# Altium schematic sheet Tiresias_PMIC.SchDoc: Tiresias PMIC
size 393 x 281 mm; Author: João Victor Colombari Carlet; CompanyName: GMETA; DrawnBy: João Victor Colombari Carlet; Engineer: João Victor Colombari Carlet; Organization: R&D GMETA; Address1: EESC - USP; Address2: 400, Trabalhador São-Carlense Av.; Address3: 13566-590, São Carlos; Address4: São Paulo, Brazil; Revision: 0; SheetNumber: 4; SheetTotal: 5; Address_Website: http://www.sel.eesc.usp.br/jcarmo/metamaterials/
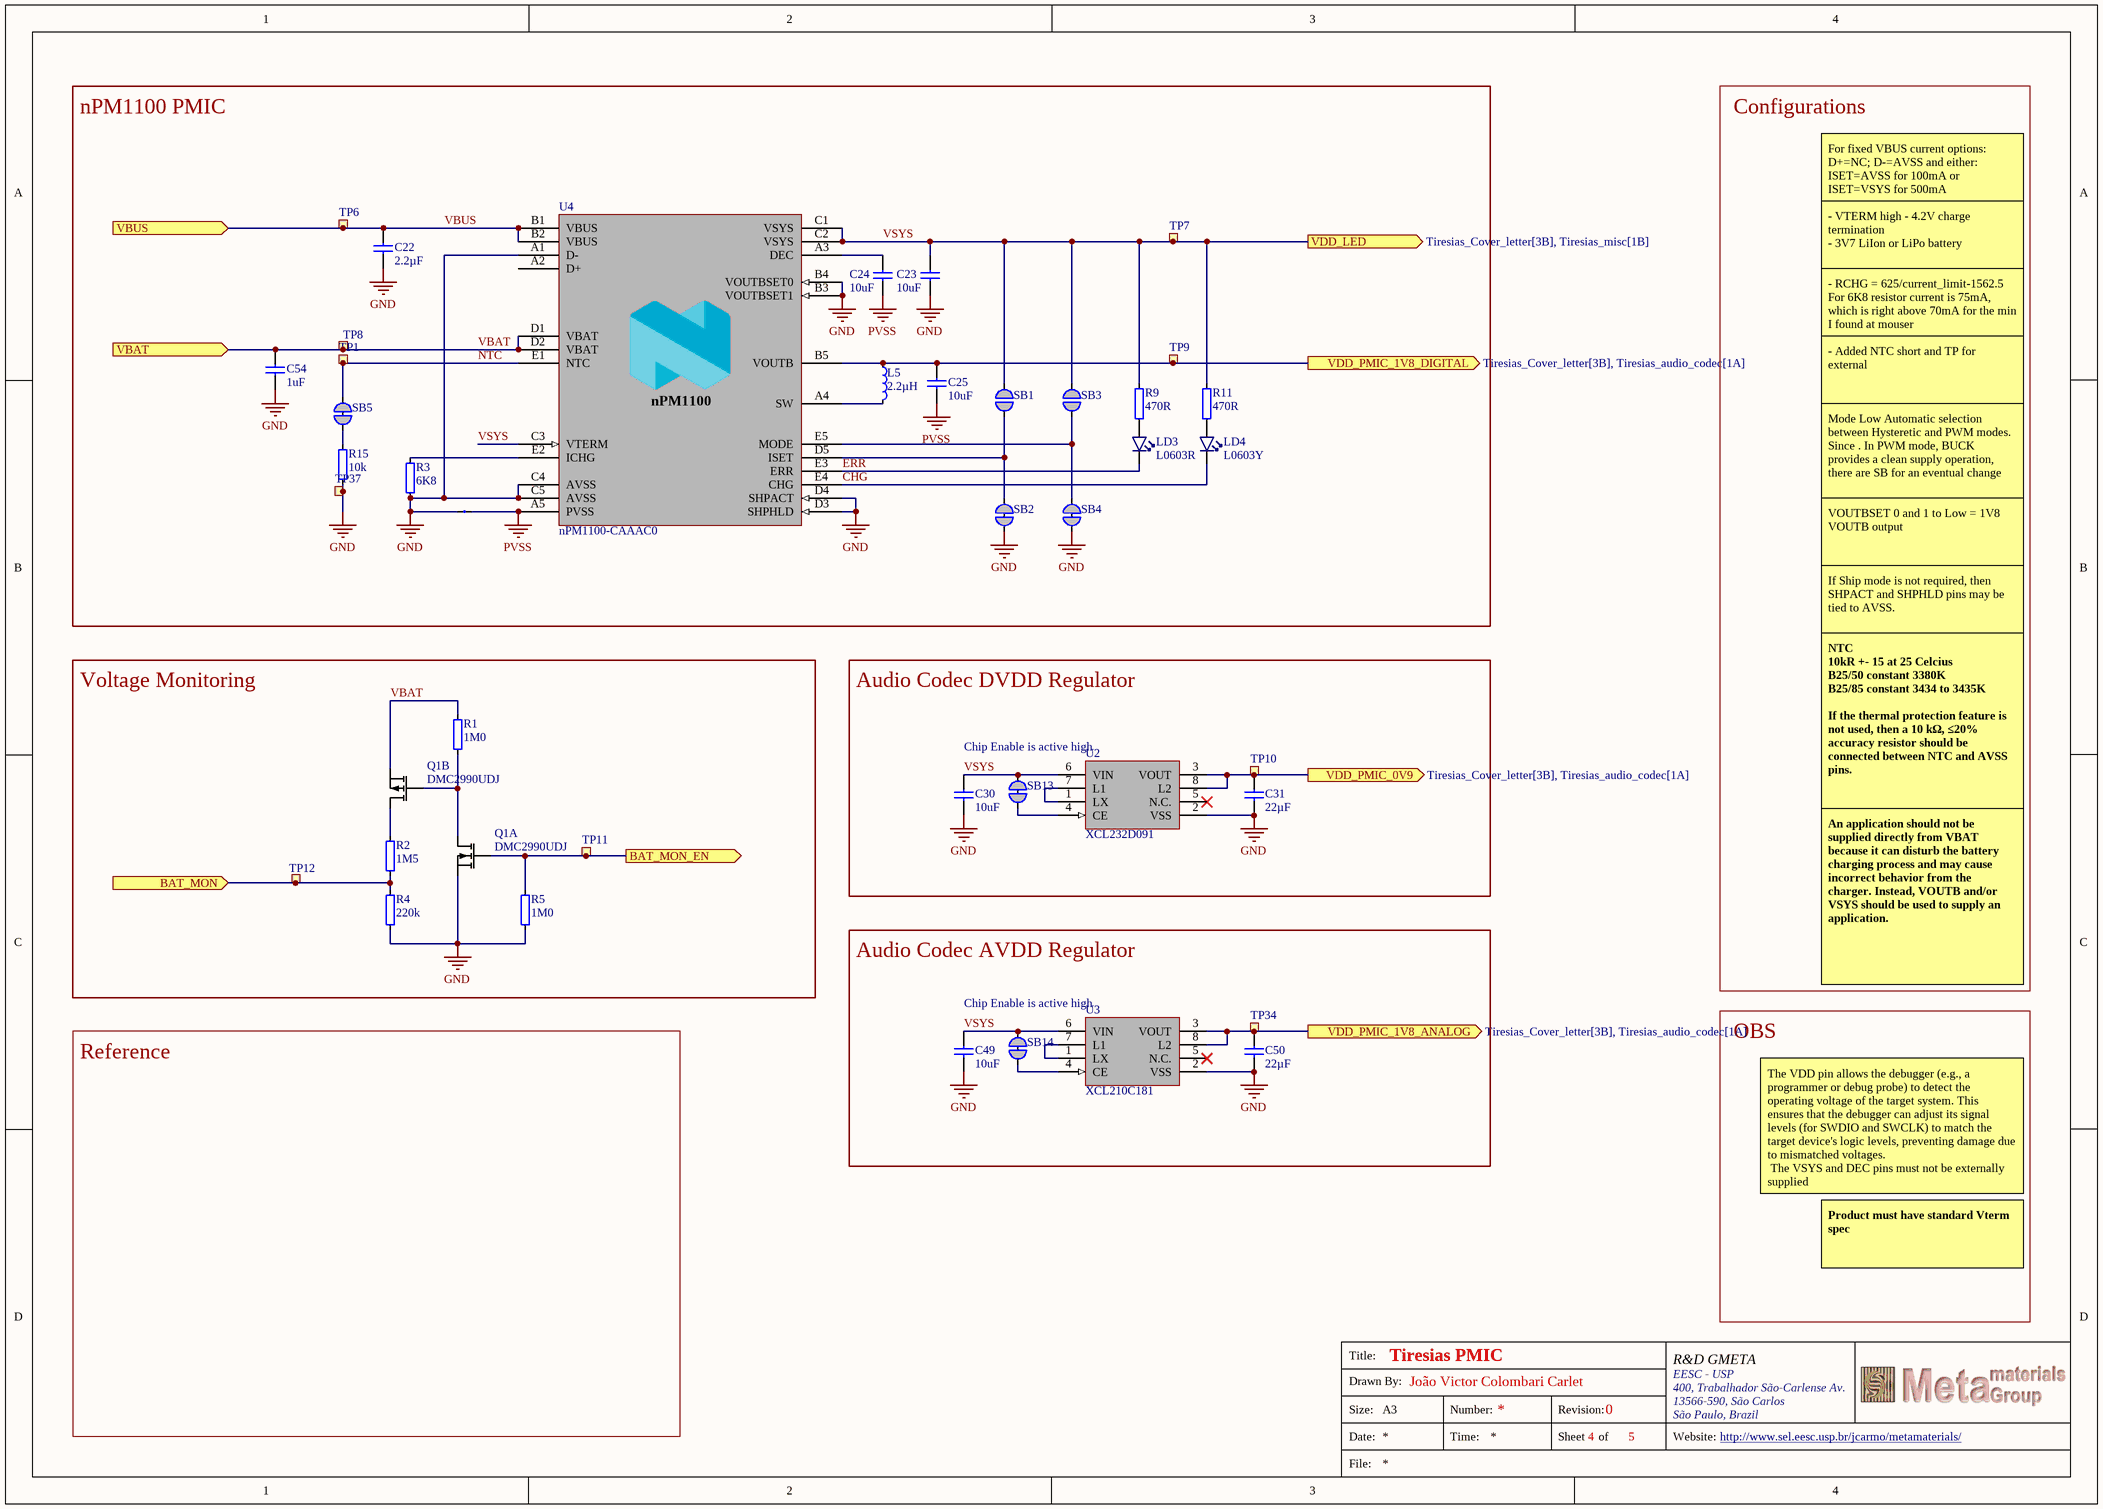
[diagram p0: Tiresias_PMIC.SchDoc]

## Parts
C22  2.2µF  [CAPC1608X06L]
C23  10uF  [CAPC1608X06L]
C24  10uF  [CAPC1608X06L]
C25  10uF  [CAPC1608X06L]
C30  10uF  [CAPC1608X06L]
C31  22µF  [CAPC1608X06L]
C49  10uF  [CAPC1608X06L]
C50  22µF  [CAPC1608X06L]
C54  1uF  [CAPC1005X04L]
J6  N.A.  [2 PIN STARPOINT]  (value not drawn)  (net tie, no BOM)
L5  2.2µH  [INDC2016X10N]
LD3  L0603R  [LED_0603_R]
LD4  L0603Y  [LED_0603_Y]
Q1  DMC2990UDJ  [SOTFL35P100X50-6N]  (parts A,B of 2)
R1  1M0  [RESC0603X03L_C]
R2  1M5  [RESC0603X03L_C]
R3  6K8  [RESC0603X03L_C]
R4  220k  [RESC0603X03L_C]
R5  1M0  [RESC0603X03L_C]
R9  470R  [RESC0603X03L_C]
R11  470R  [RESC0603X03L_C]
R15  10k  [RESC0603X03L_C]
SB1  Solderbridge  [Solderbridge]  (value not drawn)  (no BOM)
SB2  Solderbridge  [Solderbridge_Shorted]  (value not drawn)  (net tie, no BOM)
SB3  Solderbridge  [Solderbridge]  (value not drawn)  (no BOM)
SB4  Solderbridge  [Solderbridge_Shorted]  (value not drawn)  (net tie, no BOM)
SB5  Solderbridge  [Solderbridge_Shorted]  (value not drawn)  (net tie, no BOM)
SB13  Solderbridge  [Solderbridge_Shorted]  (value not drawn)  (net tie, no BOM)
SB14  Solderbridge  [Solderbridge_Shorted]  (value not drawn)  (net tie, no BOM)
TP1  Ø1.5mm,SMD  [TP_SMD_D1.5mm]  (value not drawn)  (no BOM)
TP6  Ø1.5mm,SMD  [TP_SMD_D1.5mm]  (value not drawn)  (no BOM)
TP7  Ø1.5mm,SMD  [TP_SMD_D1.5mm]  (value not drawn)  (no BOM)
TP8  Ø1.5mm,SMD  [TP_SMD_D1.5mm]  (value not drawn)  (no BOM)
TP9  Ø1.5mm,SMD  [TP_SMD_D1.5mm]  (value not drawn)  (no BOM)
TP10  Ø1.5mm,SMD  [TP_SMD_D1.5mm]  (value not drawn)  (no BOM)
TP11  Ø1.0mm,SMD  [TP_SMD_D1.0mm]  (value not drawn)  (no BOM)
TP12  Ø1.0mm,SMD  [TP_SMD_D1.0mm]  (value not drawn)  (no BOM)
TP34  Ø1.5mm,SMD  [TP_SMD_D1.5mm]  (value not drawn)  (no BOM)
TP37  Ø1.5mm,SMD  [TP_SMD_D1.5mm]  (value not drawn)  (no BOM)
U2  XCL232D091  [CL-2025]
U3  XCL210C181  [CL-2025]
U4  nPM1100-CAAAC0  [BGA25C40P5X5_200X200X50]

## Blocks framed on the sheet
nPM1100 PMIC: C22-C25 C54 J6 L5 LD3 LD4 R3 R9 R11 R15 SB1-SB5 TP1 TP6-TP9 TP37 U4
Voltage Monitoring: Q1 R1 R2 R4 R5 TP11 TP12
Audio Codec DVDD Regulator: C30 C31 SB13 TP10 U2
Audio Codec AVDD Regulator: C49 C50 SB14 TP34 U3

## Ports
BAT_MON (in, see Tiresias_Cover_letter[3B], Tiresias_MCU[4B]), BAT_MON_EN (out, see Tiresias_Cover_letter[3B], Tiresias_MCU[4B]), VBAT (in, see Tiresias_Cover_letter[3B], Tiresias_misc[1D]), VBUS (in, see Tiresias_Cover_letter[3B], Tiresias_misc[2D]), VDD_LED (out, see Tiresias_Cover_letter[3B], Tiresias_misc[1B]), VDD_PMIC_0V9 (out, see Tiresias_Cover_letter[3B], Tiresias_audio_codec[1A]), VDD_PMIC_1V8_ANALOG (out, see Tiresias_Cover_letter[3B], Tiresias_audio_codec[1A]), VDD_PMIC_1V8_DIGITAL (out, see Tiresias_Cover_letter[3B], Tiresias_audio_codec[1A])

## Nets
GND: C22.1 C23.1 C30.1 C31.1 C49.1 C50.1 C54.1 J6.1 Q1.1(S1) R3.2 R4.1 R5.1 R15.1 SB2.2 SB4.2 TP37.1 U2.2(VSS) U2.9(VSS) U3.2(VSS) U3.9(VSS) U4.A1(D-) U4.B3(VOUTBSET1) U4.B4(VOUTBSET0) U4.C4(AVSS) U4.C5(AVSS) U4.D3(SHPHLD) U4.D4(SHPACT)
PVSS: C24.1 C25.2 J6.2 U4.A5(PVSS)
BAT_MON: R2.1 R4.2 TP12.1 ; port BAT_MON
BAT_MON_EN: Q1.2(G1) R5.2 TP11.1 ; port BAT_MON_EN
CHG: LD4.1(C) U4.E4(CHG)
ERR: LD3.1(C) U4.E3(ERR)
NTC: SB5.1 TP1.1 U4.E1(NTC)
VBAT: C54.2 Q1.4(S2) R1.2 TP8.1 U4.D1(VBAT) U4.D2(VBAT) ; port VBAT
VBUS: C22.2 TP6.1 U4.B1(VBUS) U4.B2(VBUS) ; port VBUS
VDD_PMIC_0V9: C31.2 TP10.1 U2.3(VOUT) U2.8(L2) ; port VDD_PMIC_0V9
VDD_PMIC_1V8_ANALOG: C50.2 TP34.1 U3.3(VOUT) U3.8(L2) ; port VDD_PMIC_1V8_ANALOG
VDD_PMIC_1V8_DIGITAL: C25.1 L5.1 TP9.1 U4.B5(VOUTB) ; port VDD_PMIC_1V8_DIGITAL
VSYS: C23.2 C30.2 C49.2 R9.2 R11.2 SB1.1 SB3.1 SB13.1 SB14.1 TP7.1 U2.6(VIN) U3.6(VIN) U4.C1(VSYS) U4.C2(VSYS) U4.C3(VTERM) ; port VDD_LED
NetC24_2: C24.2 U4.A3(DEC)
NetL5_2: L5.2 U4.A4(SW)
NetLD3_2: LD3.2(A) R9.1
NetLD4_2: LD4.2(A) R11.1
NetQ1_3: Q1.3(D2) R2.2
NetQ1_5: Q1.5(G2) Q1.6(D1) R1.1
NetR3_1: R3.1 U4.E2(ICHG)
NetR15_2: R15.2 SB5.2
NetSB1_2: SB1.2 SB2.1 U4.D5(ISET)
NetSB3_2: SB3.2 SB4.1 U4.E5(MODE)
NetSB13_2: SB13.2 U2.4(CE)
NetSB14_2: SB14.2 U3.4(CE)
NetU2_1: U2.1(LX) U2.7(L1)
NetU3_1: U3.1(LX) U3.7(L1)

Not connected (* = marked no-connect by the designer): U2 5(N.C.)*; U3 5(N.C.)*; U4 A2(D+)

## Notes on the sheet
- Configurations
- For fixed VBUS current options:
  D+=NC; D-=AVSS and either:
  ISET=AVSS for 100mA or
  ISET=VSYS for 500mA
- - VTERM high - 4.2V charge termination
  - 3V7 LiIon or LiPo battery
- - RCHG = 625/current_limit-1562.5
  For 6K8 resistor current is 75mA,
  which is right above 70mA for the min I found at mouser
- - Added NTC short and TP for external
- Mode Low Automatic selection between Hysteretic and PWM modes. Since . In PWM mode, BUCK provides a clean supply operation, there are SB for an eventual change
- VOUTBSET 0 and 1 to Low = 1V8 VOUTB output
- If Ship mode is not required, then SHPACT and SHPHLD pins may be tied to AVSS.
- Chip Enable is active high
- NTC
  10kR +- 15 at 25 Celcius
  B25/50 constant 3380K
  B25/85 constant 3434 to 3435K
  If the thermal protection feature is not used, then a 10 kΩ, ≤20% accuracy resistor should be connected between NTC and AVSS pins.
- An application should not be supplied directly from VBAT because it can disturb the battery charging process and may cause incorrect behavior from the charger. Instead, VOUTB and/or VSYS should be used to supply an application.
- OBS
- Reference
- The VDD pin allows the debugger (e.g., a programmer or debug probe) to detect the operating voltage of the target system. This ensures that the debugger can adjust its signal levels (for SWDIO and SWCLK) to match the target device's logic levels, preventing damage due to mismatched voltages.
  The VSYS and DEC pins must not be externally supplied
- Product must have standard Vterm spec
- Title:
- Drawn By:
- Size:
- Date:
- File:
- A3
- Number:
- Time:
- Revision:
- Sheet
- of
- Website:
- (in symbol nPM1100-CAAAC0) nPM1100

## Library data of the parts
C22 = CAP_0603_2u2F: Capacitor, Ceramic, X5R, ±10%, 10V; Part Number: C0603-2µ2-10V-X5R; Manufacturer: N.A.; Pad Count: 2; Footprint Doc: 0603; Value: 2.2µF; Component Class: Capacitors; Author: rubr; Manufacturer Part Number: N.A.; ComponentLink1URL: N.A.; ComponentLink1Description: Datasheet; ComponentLink2URL: N.A.; ComponentLink2Description: Supplier link; HelpURL: N.A.; LatestRevisionDate: 2021-07-22; Published: 2021-07-22; Note: 10V; Supplier 1: N.A.; Supplier Part Number 1: N.A.; Supplier 2: N.A.; Supplier Part Number 2: N.A.; Artikkelnr Noca: N.A.; Part number IPS: N.A.; Part number Norautron: N.A.
C23-C25 C30 C49 = CAP_0603_10uF: Capacitor, X5R, ±10%; Part Number: C0603-10µ; Class: SMT; Manufacturer: *; Manufacturer Part Number: *; LatestRevisionDate: 2024/02/20; Value: 10uF; Package: 0603; Pin Count: 2
C31 C50 = CAP_0603_22uF: Capacitor, X5R, ±20%, 6.3V; Part Number: C0603-22µ; Manufacturer: N.A.; Pad Count: 2; Manufacturer Part Number: N.A.; Footprint Doc: 0603; LatestRevisionDate: 2020-09-23; Published: 2020-09-23; Value: 22µF; Note: 6.3V; Artikkelnr Noca: N.A.; Part number IPS: N.A.; ComponentLink1URL: N.A.; ComponentLink1Description: Datasheet; ComponentLink2URL: N.A.; ComponentLink2Description: Supplier link; HelpURL: N.A.; Supplier 1: N.A.; Supplier Part Number 1: N.A.; Supplier 2: N.A.; Supplier Part Number 2: N.A.; Component Class: Capacitors; PartId: 100200276; Author: rsk; Part number Norautron: N.A.
C54 = CAP_0402_1uF: Capacitor, X5R, ±5%; Part Number: C0402-1µ0; Class: SMT; Manufacturer: *; Manufacturer Part Number: *; LatestRevisionDate: 2024/02/20; Value: 1uF; Package: 0402; Pin Count: 2
J6 = 2 pin starpoint: Starpoint; Pad Count: 2; Footprint Doc: N.A.; Value: N.A.; Component Class: Connectors; Author: rsk; Part Number: 2 pin starpoint; PartId: 100500603; Manufacturer: N.A.; Manufacturer Part Number: N.A.; ComponentLink1URL: N.A.; ComponentLink1Description: Datasheet; ComponentLink2URL: N.A.; ComponentLink2Description: Supplier link; HelpURL: N.A.; LatestRevisionDate: 2017-08-31; Published: 2017-08-31; Note: N.A.; Supplier 1: N.A.; Supplier Part Number 1: N.A.; Supplier 2: N.A.; Supplier Part Number 2: N.A.; Artikkelnr Noca: N.A.; Part number IPS: N.A.; Part number Norautron: N.A.
L5 = IND_0806_2u2H: FIXED IND 2.2UH 2.5A 87MOHM SMD; Part Number: CIGT201610EH2R2MNE; Manufacturer: Samsung Electro-Mechanics; Pad Count: 2; Note: 2.2µH Unshielded Thin Film Inductor 2.5A 87mOhm Max 0806 (2016 Metric); Artikkelnr Noca: N.A.; Footprint Doc: 0806; Value: 2.2µH; Component Class: Inductors; Author: rsk; PartId: 100300400; Manufacturer Part Number: CIGT201610EH2R2MNE; ComponentLink1URL: https://media.digikey.com/pdf/Data%20Sheets/Samsung%20PDFs/CIGT201610EH2R2MNE_Spec.pdf; ComponentLink1Description: Datasheet; ComponentLink2URL: https://www.digikey.com/en/products/detail/samsung-electro-mechanics/CIGT201610EH2R2MNE/7041223?s=N4IgTCBcDaIMIEkDiAVMAGAjANk%2BgogBJgBKYAsgHL4gC6AvkA; ComponentLink2Description: Supplier link; HelpURL: http://product.samsungsem.com/pi/CIGT201610EH2R2MN.do; LatestRevisionDate: 2021-02-03; Published: 2021-02-03; Supplier 1: Digi-Key; Supplier Part Number 1: 1276-6901-1-ND; Supplier 2: Mouser; Supplier Part Number 2: 187-CIGT201610EH2R2M; Part number IPS: N.A.; Part number Norautron: N.A.
LD3 = LED_0603_RED: LED, SMD, 0603, RED; Part Number: OVS-0608 RED; Manufacturer: Multicomp; Pad Count: 2; Note: 100 mcd @ 20 mA, Super bright; Artikkelnr Noca: N.A.; Footprint Doc: 0603; Value: L0603R; Component Class: Optoelectronics; Author: rsk; PartId: 101400024; Manufacturer Part Number: OVS-0608; ComponentLink1URL: N.A.; ComponentLink1Description: Datasheet; ComponentLink2URL: N.A.; ComponentLink2Description: Supplier link; HelpURL: http://www.farnell.com/datasheets/1673654.pdf; LatestRevisionDate: 2011-10-28; Published: 2011-10-28; Supplier 1: Farnell; Supplier Part Number 1: 171-6774; Supplier 2: N.A.; Supplier Part Number 2: N.A.; Part number IPS: N.A.; Part number Norautron: N.A.
LD4 = LED_0603_YEL: LED, Yellow, 0603, 590nm, Vf=2.0V, 120mcd, - 40 to +85°C; Part Number: 150060YS75000; Manufacturer: Wurth Elektronik; Note: N.A.; Pad Count: 2; Manufacturer Part Number: 150060YS75000; ComponentLink1URL: https://katalog.we-online.de/led/datasheet/150060YS75000.pdf; ComponentLink1Description: Datasheet; ComponentLink2URL: https://www.digikey.com/en/products/detail/w%C3%BCrth-elektronik/150060YS75000/4489909; ComponentLink2Description: Supplier link; HelpURL: N.A.; Footprint Doc: 0603; LatestRevisionDate: 2020-11-04; Published: 2020-11-04; Value: L0603Y; Supplier 1: Digi-Key; Supplier Part Number 1: 732-4981-1-ND; Supplier 2: N.A.; Supplier Part Number 2: N.A.; Artikkelnr Noca: N.A.; Part number IPS: N.A.; Component Class: Optoelectronics; PartId: 101400136; Author: rsk; Part number Norautron: N.A.
Q1 = DMC2990UDJ-7: MOSFET, Dual N and P-Channel, 20V, 450mA/310mA, 990mOhm, 350mW; Manufacturer: Diodes Incorporated; Part number IPS: 00000004489; Note: N.A.; Pad Count: 6; Part Number: DMC2990UDJ-7; Manufacturer Part Number: DMC2990UDJ-7; Footprint Doc: SOT-963; LatestRevisionDate: 2020-04-28; Published: 2020-02-21; Value: DMC2990UDJ; Artikkelnr Noca: N.A.; Supplier 1: Digi-Key; Supplier Part Number 1: DMC2990UDJ-7DICT-ND; Supplier 2: N.A.; Supplier Part Number 2: N.A.; ComponentLink1URL: https://www.diodes.com/assets/Datasheets/DMC2990UDJ.pdf; ComponentLink1Description: Datasheet; ComponentLink2URL: N.A.; ComponentLink2Description: Supplier link; HelpURL: N.A.; Component Class: Semiconductors; PartId: 101300174; Author: rsk; Part number Norautron: N.A.
R1 R5 = RES_0201_1M0: Resistor, ±1%, 0.05W; Part Number: R0201-100k; Manufacturer: N.A.; Class: SMT; Latest Revision Date: 2024-04-23; ComponentLink1URL: N.A.; ComponentLink1Description: Datasheet; ComponentLink2URL: N.A.; ComponentLink2Description: Supplier link; Value: 1M0; Package: 0201; Pin Count: 2; JLCpcb link: Chip Res 1%; Mouser link: N.A.; DigiKey link: 00000001419; Author: rsk
R2 = RES_0201_1M5: Resistor, ±1%, 0.05W; Part Number: R0201-100k; Manufacturer: N.A.; Class: SMT; Latest Revision Date: 2024-04-23; ComponentLink1URL: N.A.; ComponentLink1Description: Datasheet; ComponentLink2URL: N.A.; ComponentLink2Description: Supplier link; Value: 1M5; Package: 0201; Pin Count: 2; JLCpcb link: Chip Res 1%; Mouser link: N.A.; DigiKey link: 00000001419; Author: rsk
R3 = RES_0201_6K8: Resistor, ±1%, 0.05W; Part Number: R0201-100k; Manufacturer: N.A.; Class: SMT; Latest Revision Date: 2024-04-23; ComponentLink1URL: N.A.; ComponentLink1Description: Datasheet; ComponentLink2URL: N.A.; ComponentLink2Description: Supplier link; Value: 6K8; Package: 0201; Pin Count: 2; JLCpcb link: Chip Res 1%; Mouser link: N.A.; DigiKey link: 00000001419; Author: rsk
R4 = RES_0201_220K: Resistor, ±1%, 0.05W; Part Number: R0201-100k; Manufacturer: N.A.; Class: SMT; Latest Revision Date: 2024-04-23; ComponentLink1URL: N.A.; ComponentLink1Description: Datasheet; ComponentLink2URL: N.A.; ComponentLink2Description: Supplier link; Value: 220k; Package: 0201; Pin Count: 2; JLCpcb link: Chip Res 1%; Mouser link: N.A.; DigiKey link: 00000001419; Author: rsk
R9 R11 = RES_0201_470R: Resistor, ±1%, 0.05W; Part Number: R0201-470; Manufacturer: N.A.; Note: Chip Res 1%; Pad Count: 2; Manufacturer Part Number: N.A.; ComponentLink1URL: N.A.; ComponentLink1Description: Datasheet; ComponentLink2URL: N.A.; ComponentLink2Description: Supplier link; HelpURL: N.A.; Footprint Doc: 0201; LatestRevisionDate: 2014-11-13; Published: 2014-11-13; Value: 470R; Artikkelnr Noca: N.A.; Part number IPS: N.A.; Supplier 1: N.A.; Supplier Part Number 1: N.A.; Supplier 2: N.A.; Supplier Part Number 2: N.A.; Component Class: Resistors; PartId: 100100037; Author: rsk; Part number Norautron: N.A.
R15 = RES_0201_10K: Resistor, ±1%, 0.05W; Part Number: R0201-100k; Manufacturer: N.A.; Class: SMT; Latest Revision Date: 2024-04-23; ComponentLink1URL: N.A.; ComponentLink1Description: Datasheet; ComponentLink2URL: N.A.; ComponentLink2Description: Supplier link; Value: 10k; Package: 0201; Pin Count: 2; JLCpcb link: Chip Res 1%; Mouser link: N.A.; DigiKey link: 00000001419; Author: rsk
SB1 SB3 = Solderbridge: Manufacturer: N.A.; Pad Count: 2; Part Number: Solderbridge; Manufacturer Part Number: N.A.; ComponentLink1URL: N.A.; ComponentLink1Description: Datasheet; ComponentLink2URL: N.A.; ComponentLink2Description: Supplier link; HelpURL: N.A.; Footprint Doc: Solderbridge; LatestRevisionDate: 2009-12-14; Published: 2009-12-14; Value: Solderbridge; Note: N.A.; Supplier 1: N.A.; Supplier Part Number 1: N.A.; Supplier 2: N.A.; Supplier Part Number 2: N.A.; Artikkelnr Noca: N.A.; Part number IPS: N.A.; Component Class: Connectors; PartId: 100500458; Author: rsk; Part number Norautron: N.A.
SB2 SB4 SB5 SB13 SB14 = Solderbridge Shorted: Shorted Solderbridge; Manufacturer: N.A.; Pad Count: 2; Part Number: Solderbridge Shorted; Manufacturer Part Number: N.A.; ComponentLink1URL: N.A.; ComponentLink1Description: Datasheet; ComponentLink2URL: N.A.; ComponentLink2Description: Supplier link; HelpURL: N.A.; Footprint Doc: Solderbridge_Shorted; LatestRevisionDate: 2012-08-07; Published: 2012-08-07; Value: Solderbridge; Note: N.A.; Supplier 1: N.A.; Supplier Part Number 1: N.A.; Supplier 2: N.A.; Supplier Part Number 2: N.A.; Artikkelnr Noca: N.A.; Part number IPS: N.A.; Component Class: Connectors; PartId: 100500459; Author: rsk; Part number Norautron: N.A.
TP1 TP6-TP10 TP34 TP37 = TP_SMD_Ø1.5MM: 1.5mm circular SMD testpad; Manufacturer: Nordic Semiconductor; Manufacturer Part Number: N.A.; Pad Count: 1; Part Number: TP_SMD_Ø1.5MM; LatestRevisionDate: 2021-03-05; Published: 2016-06-02; Value: Ø1.5mm,SMD; Note: N.A.; Artikkelnr Noca: N.A.; Footprint Doc: TP_SMD_Ø1.5mm; Part number IPS: N.A.; ComponentLink1URL: N.A.; ComponentLink1Description: Datasheet; ComponentLink2URL: N.A.; ComponentLink2Description: Supplier link; HelpURL: N.A.; Supplier 1: N.A.; Supplier Part Number 1: N.A.; Supplier 2: N.A.; Supplier Part Number 2: N.A.; Component Class: Connectors; PartId: 100500477; Author: rsk; Part number Norautron: N.A.
TP11 TP12 = TP_SMD_Ø1.0MM: 1.0mm circular SMD testpad; Manufacturer: Nordic Semiconductor; Manufacturer Part Number: N.A.; Pad Count: 1; Part Number: TP_SMD_Ø1.0MM; ComponentLink1URL: N.A.; ComponentLink1Description: Datasheet; ComponentLink2URL: N.A.; ComponentLink2Description: Supplier link; HelpURL: N.A.; Footprint Doc: TP_SMD_Ø1.0mm; LatestRevisionDate: 2021-03-05; Published: 2013-06-11; Value: Ø1.0mm,SMD; Note: N.A.; Supplier 1: N.A.; Supplier Part Number 1: N.A.; Supplier 2: N.A.; Supplier Part Number 2: N.A.; Artikkelnr Noca: N.A.; Part number IPS: N.A.; Component Class: Connectors; PartId: 100500475; Author: rsk; Part number Norautron: N.A.
U2 = XCL232D091KR-G: 0.9V Ultra-Low Quiescent Current, Inductor Built-in Step-Down DC/DC Converter, CL-2025-03   Source:  Datasheet; Part Number: XCL210C12; Manufacturer: Torex Semiconductor; Manufacturer Part Number: XCL210C121GR-G; Note: N.A.; Pad Count: 8; Footprint Doc: CL-2025; LatestRevisionDate: 2021-04-22; Published: 2021-04-22; Value: XCL232D091; Artikkelnr Noca: N.A.; Part number IPS: N.A.; ComponentLink1URL: https://www.torexsemi.com/file/xcl210/XCL210.pdf; ComponentLink1Description: Datasheet; ComponentLink2URL: https://www.digikey.com/en/products/detail/torex-semiconductor-ltd/XCL210C121GR-G/5964723; ComponentLink2Description: Supplier link; HelpURL: https://www.torexsemi.com/products/built-in-dcdc-converters/series/?name=xcl210; Supplier 1: Digi-Key; Supplier Part Number 1: 893-1249-1-ND; Supplier 2: Mouser; Supplier Part Number 2: 865-XCL210C121GR-G; Component Class: Misc_ICs; Author: rubr; Part number Norautron: N.A.; PartId: 101900655; Mouser Link: https://au.mouser.com/ProductDetail/Torex-Semiconductor/XCL210D201GR-G?qs=AsjdqWjXhJ%252Bfq4YmN5RHyA%3D%3D&_gl=1*8wexd*_ga*MTYyMjg1NzA0OC4xNzEzODc4NTc0*_ga_15W4STQT4T*MTcxMzk3OTMxMS4zLjAuMTcxMzk3OTMxMi41OS4wLjA.; Digikey Link: https://www.digikey.com/en/products/detail/torex-semiconductor-ltd/XCL210D201GR-G/10148097?s=N4IgTCBcDaIBoGEAyYCMAGAImdqDiASgLR4gC6AvkA
U3 = XCL210C18: 1.8V, 200mA Inductor Built-in Step-Down “micro DC/DC” Converter; Part Number: XCL210C12; Manufacturer: Torex Semiconductor; Manufacturer Part Number: XCL210C121GR-G; Note: N.A.; Pad Count: 8; Footprint Doc: CL-2025; LatestRevisionDate: 2021-04-22; Published: 2021-04-22; Value: XCL210C181; Artikkelnr Noca: N.A.; Part number IPS: N.A.; ComponentLink1URL: https://www.torexsemi.com/file/xcl210/XCL210.pdf; ComponentLink1Description: Datasheet; ComponentLink2URL: https://www.digikey.com/en/products/detail/torex-semiconductor-ltd/XCL210C121GR-G/5964723; ComponentLink2Description: Supplier link; HelpURL: https://www.torexsemi.com/products/built-in-dcdc-converters/series/?name=xcl210; Supplier 1: Digi-Key; Supplier Part Number 1: 893-1249-1-ND; Supplier 2: Mouser; Supplier Part Number 2: 865-XCL210C121GR-G; Component Class: Misc_ICs; Author: rubr; Part number Norautron: N.A.; PartId: 101900655; Mouser Link: https://au.mouser.com/ProductDetail/Torex-Semiconductor/XCL210D201GR-G?qs=AsjdqWjXhJ%252Bfq4YmN5RHyA%3D%3D&_gl=1*8wexd*_ga*MTYyMjg1NzA0OC4xNzEzODc4NTc0*_ga_15W4STQT4T*MTcxMzk3OTMxMS4zLjAuMTcxMzk3OTMxMi41OS4wLjA.; Digikey Link: https://www.digikey.com/en/products/detail/torex-semiconductor-ltd/XCL210D201GR-G/10148097?s=N4IgTCBcDaIBoGEAyYCMAGAImdqDiASgLR4gC6AvkA
U4 = nPM1100-CAAAC0: Li-Ion/Li-Polymer USB battery charger with a high efficiency buck regulator; Manufacturer: Nordic Semiconductor; Pad Count: 25; Note: N.A.; Footprint Doc: WLCSP-25; Value: nPM1100-CAAAC0; Component Class: nRF_Devices; Author: rubr; Part Number: nPM1100-CAAAC0; Manufacturer Part Number: nPM1100-CAAAC0; ComponentLink1URL: N.A.; ComponentLink1Description: Datasheet; ComponentLink2URL: N.A.; ComponentLink2Description: Supplier link; HelpURL: N.A.; LatestRevisionDate: 2021-04-21; Published: 2021-04-21; Supplier 1: Nordic Semiconductor; Supplier Part Number 1: N.A.; Supplier 2: N.A.; Supplier Part Number 2: N.A.; Artikkelnr Noca: N.A.; Part number IPS: N.A.; Part number Norautron: N.A.; PartId: 102000225